# EAGLE schematic tf330 (EAGLE 9.5.2)

## Sheet 1 of 3
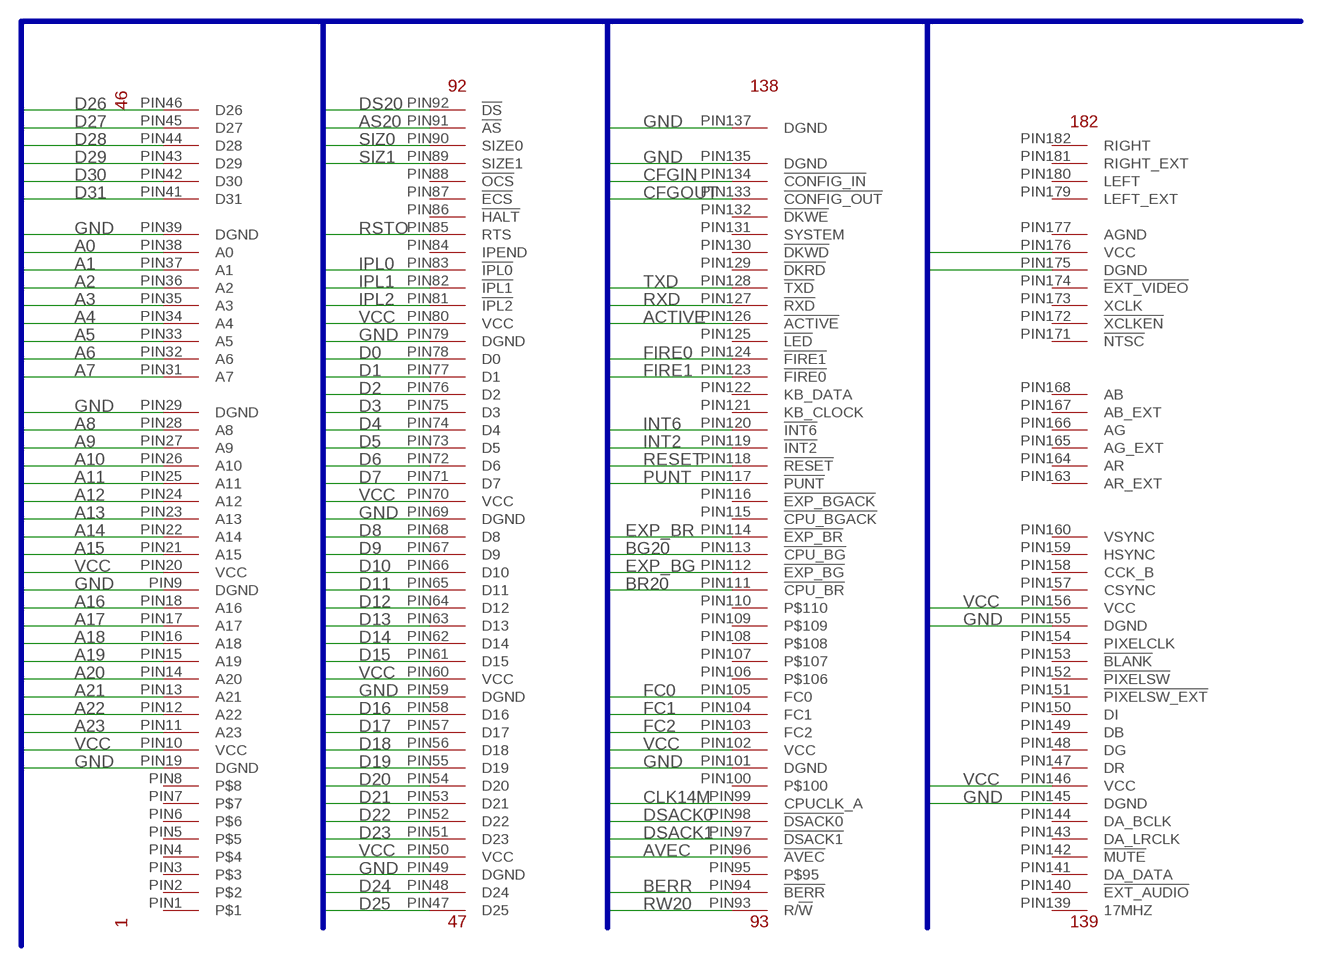
[diagram p0: schematic, sheet 1]

### Parts
CONN1  MCA_CONN_182  [MCA_CONN_182]

### Nets
A0: CONN1.PIN38(A0) ; also sheet 2
A1: CONN1.PIN37(A1) ; also sheet 2
A2: CONN1.PIN36(A2) ; also sheet 2
A3: CONN1.PIN35(A3) ; also sheet 2
A4: CONN1.PIN34(A4) ; also sheet 2
A5: CONN1.PIN33(A5) ; also sheet 2
A6: CONN1.PIN32(A6) ; also sheet 2
A7: CONN1.PIN31(A7) ; also sheet 2
A8: CONN1.PIN28(A8) ; also sheet 2
A9: CONN1.PIN27(A9) ; also sheet 2
A10: CONN1.PIN26(A10) ; also sheet 2
A11: CONN1.PIN25(A11) ; also sheet 2
A12: CONN1.PIN24(A12) ; also sheet 2
A13: CONN1.PIN23(A13) ; also sheet 2
A14: CONN1.PIN22(A14) ; also sheet 2
A15: CONN1.PIN21(A15) ; also sheet 2
A16: CONN1.PIN18(A16) ; also sheet 2
A17: CONN1.PIN17(A17) ; also sheet 2
A18: CONN1.PIN16(A18) ; also sheet 2
A19: CONN1.PIN15(A19) ; also sheet 2
A20: CONN1.PIN14(A20) ; also sheet 2
A21: CONN1.PIN13(A21) ; also sheet 2
A22: CONN1.PIN12(A22) ; also sheet 2
A23: CONN1.PIN11(A23) ; also sheet 2
ACTIVE: CONN1.PIN126(!ACTIVE) ; also sheet 2
AS20: CONN1.PIN91(!AS) ; also sheet 2
AVEC: CONN1.PIN96(!AVEC) ; also sheet 2
BERR: CONN1.PIN94(!BERR) ; also sheet 2
BG20: CONN1.PIN113(!CPU_BG) ; also sheet 2
BR20: CONN1.PIN111(!CPU_BR) ; also sheet 2
CFGIN: CONN1.PIN134(!CONFIG_IN)
CFGOUT: CONN1.PIN133(!CONFIG_OUT)
CLK14M: CONN1.PIN99(CPUCLK_A) ; also sheet 2
D0: CONN1.PIN78(D0) ; also sheet 2,3
D1: CONN1.PIN77(D1) ; also sheet 2,3
D2: CONN1.PIN76(D2) ; also sheet 2,3
D3: CONN1.PIN75(D3) ; also sheet 2,3
D4: CONN1.PIN74(D4) ; also sheet 2,3
D5: CONN1.PIN73(D5) ; also sheet 2,3
D6: CONN1.PIN72(D6) ; also sheet 2,3
D7: CONN1.PIN71(D7) ; also sheet 2,3
D8: CONN1.PIN68(D8) ; also sheet 2,3
D9: CONN1.PIN67(D9) ; also sheet 2,3
D10: CONN1.PIN66(D10) ; also sheet 2,3
D11: CONN1.PIN65(D11) ; also sheet 2,3
D12: CONN1.PIN64(D12) ; also sheet 2,3
D13: CONN1.PIN63(D13) ; also sheet 2,3
D14: CONN1.PIN62(D14) ; also sheet 2,3
D15: CONN1.PIN61(D15) ; also sheet 2,3
D16: CONN1.PIN58(D16) ; also sheet 2,3
D17: CONN1.PIN57(D17) ; also sheet 2,3
D18: CONN1.PIN56(D18) ; also sheet 2,3
D19: CONN1.PIN55(D19) ; also sheet 2,3
D20: CONN1.PIN54(D20) ; also sheet 2,3
D21: CONN1.PIN53(D21) ; also sheet 2,3
D22: CONN1.PIN52(D22) ; also sheet 2,3
D23: CONN1.PIN51(D23) ; also sheet 2,3
D24: CONN1.PIN48(D24) ; also sheet 2,3
D25: CONN1.PIN47(D25) ; also sheet 2,3
D26: CONN1.PIN46(D26) ; also sheet 2,3
D27: CONN1.PIN45(D27) ; also sheet 2,3
D28: CONN1.PIN44(D28) ; also sheet 2,3
D29: CONN1.PIN43(D29) ; also sheet 2,3
D30: CONN1.PIN42(D30) ; also sheet 2,3
D31: CONN1.PIN41(D31) ; also sheet 2,3
DS20: CONN1.PIN92(!DS) ; also sheet 2
DSACK0: CONN1.PIN98(!DSACK0) ; also sheet 2
DSACK1: CONN1.PIN97(!DSACK1) ; also sheet 2
EXP_BG: CONN1.PIN112(!EXP_BG) ; also sheet 2
EXP_BR: CONN1.PIN114(!EXP_BR) ; also sheet 2
FC0: CONN1.PIN105(FC0) ; also sheet 2
FC1: CONN1.PIN104(FC1) ; also sheet 2
FC2: CONN1.PIN103(FC2) ; also sheet 2
FIRE0: CONN1.PIN124(!FIRE1)
FIRE1: CONN1.PIN123(!FIRE0)
GND: CONN1.PIN9(DGND) CONN1.PIN19(DGND) CONN1.PIN29(DGND) CONN1.PIN39(DGND) CONN1.PIN49(DGND) CONN1.PIN59(DGND) CONN1.PIN69(DGND) CONN1.PIN79(DGND) CONN1.PIN101(DGND) CONN1.PIN135(DGND) CONN1.PIN137(DGND) CONN1.PIN145(DGND) CONN1.PIN155(DGND) CONN1.PIN175(DGND) ; also sheet 2,3
INT2: CONN1.PIN119(!INT2) ; also sheet 2
INT6: CONN1.PIN120(!INT6)
IPL0: CONN1.PIN83(!IPL0) ; also sheet 2
IPL1: CONN1.PIN82(!IPL1) ; also sheet 2
IPL2: CONN1.PIN81(!IPL2) ; also sheet 2
PUNT: CONN1.PIN117(!PUNT) ; also sheet 2
RESET: CONN1.PIN118(!RESET) ; also sheet 2
RSTO: CONN1.PIN85(RTS) ; also sheet 2
RW20: CONN1.PIN93(R/!W) ; also sheet 2
RXD: CONN1.PIN127(!RXD) ; also sheet 2
SIZ0: CONN1.PIN90(SIZE0) ; also sheet 2
SIZ1: CONN1.PIN89(SIZE1) ; also sheet 2
TXD: CONN1.PIN128(!TXD) ; also sheet 2
VCC: CONN1.PIN10(VCC) CONN1.PIN20(VCC) CONN1.PIN50(VCC) CONN1.PIN60(VCC) CONN1.PIN70(VCC) CONN1.PIN80(VCC) CONN1.PIN102(VCC) CONN1.PIN146(VCC) CONN1.PIN156(VCC) CONN1.PIN176(VCC) ; also sheet 2
Unconnected: CONN1.PIN1 CONN1.PIN2 CONN1.PIN3 CONN1.PIN4 CONN1.PIN5 CONN1.PIN6 CONN1.PIN7 CONN1.PIN8 CONN1.PIN84(IPEND) CONN1.PIN86(!HALT) CONN1.PIN87(!ECS) CONN1.PIN88(!OCS) CONN1.PIN95 CONN1.PIN100 CONN1.PIN106 CONN1.PIN107 CONN1.PIN108 CONN1.PIN109 CONN1.PIN110 CONN1.PIN115(!CPU_BGACK) CONN1.PIN116(!EXP_BGACK) CONN1.PIN121(KB_CLOCK) CONN1.PIN122(KB_DATA) CONN1.PIN125(!LED) CONN1.PIN129(!DKRD) CONN1.PIN130(!DKWD) CONN1.PIN131(SYSTEM) CONN1.PIN132(!DKWE) CONN1.PIN139(17MHZ) CONN1.PIN140(!EXT_AUDIO) CONN1.PIN141(DA_DATA) CONN1.PIN142(!MUTE) CONN1.PIN143(DA_LRCLK) CONN1.PIN144(DA_BCLK) CONN1.PIN147(DR) CONN1.PIN148(DG) CONN1.PIN149(DB) CONN1.PIN150(DI) CONN1.PIN151(!PIXELSW_EXT) CONN1.PIN152(!PIXELSW) CONN1.PIN153(!BLANK) CONN1.PIN154(PIXELCLK) CONN1.PIN157(CSYNC) CONN1.PIN158(CCK_B) CONN1.PIN159(HSYNC) CONN1.PIN160(VSYNC) CONN1.PIN163(AR_EXT) CONN1.PIN164(AR) CONN1.PIN165(AG_EXT) CONN1.PIN166(AG) CONN1.PIN167(AB_EXT) CONN1.PIN168(AB) CONN1.PIN171(!NTSC) CONN1.PIN172(!XCLKEN) CONN1.PIN173(XCLK) CONN1.PIN174(!EXT_VIDEO) CONN1.PIN179(LEFT_EXT) CONN1.PIN180(LEFT) CONN1.PIN181(RIGHT_EXT) CONN1.PIN182(RIGHT)

### Buses
VCC,VCC33,GND,AGND,CLK100M,CLK50M,CLKCPU,CLK14M,CLKRAM,CLKRAME,A[0..31],ACTIVE,ARAM[0..12],AS30,AS20,AUX[0..2],AVEC,BA[0..1],BERR,BG30,BG20,BGACK20,BGACK30,BR20,BR30,BUSEN,CAS,CBACK,CBREQ,CDIS,CFGIN,CFGOUT,CIIN,CIIOUT,D[0..31],DRAM[0..31],DBEN,DQM[0..3],DS20,DS30,DSACK[0..1],DS30ACK[0..1],EXP_BR,EXP_BG,FC[0..2],FIRE[0..1],HALT,IDECS[0..1],IDEINT,IDELED,IDEWAIT,INT2,INT6,INTCYCLE,IOR,IOW,IPL[0..2],MMUDIS,PUNT,RAMCS,RAMOE,RAMWE,RAS,REFILL,RESET,RSTO,RW20,RW30,RXD,RXD_EXT,SIZ[0..1],SPARE,STATUS,STERM,TXD,TXD_EXT,TCK,TDI,TDO,TMS

## Sheet 2 of 3
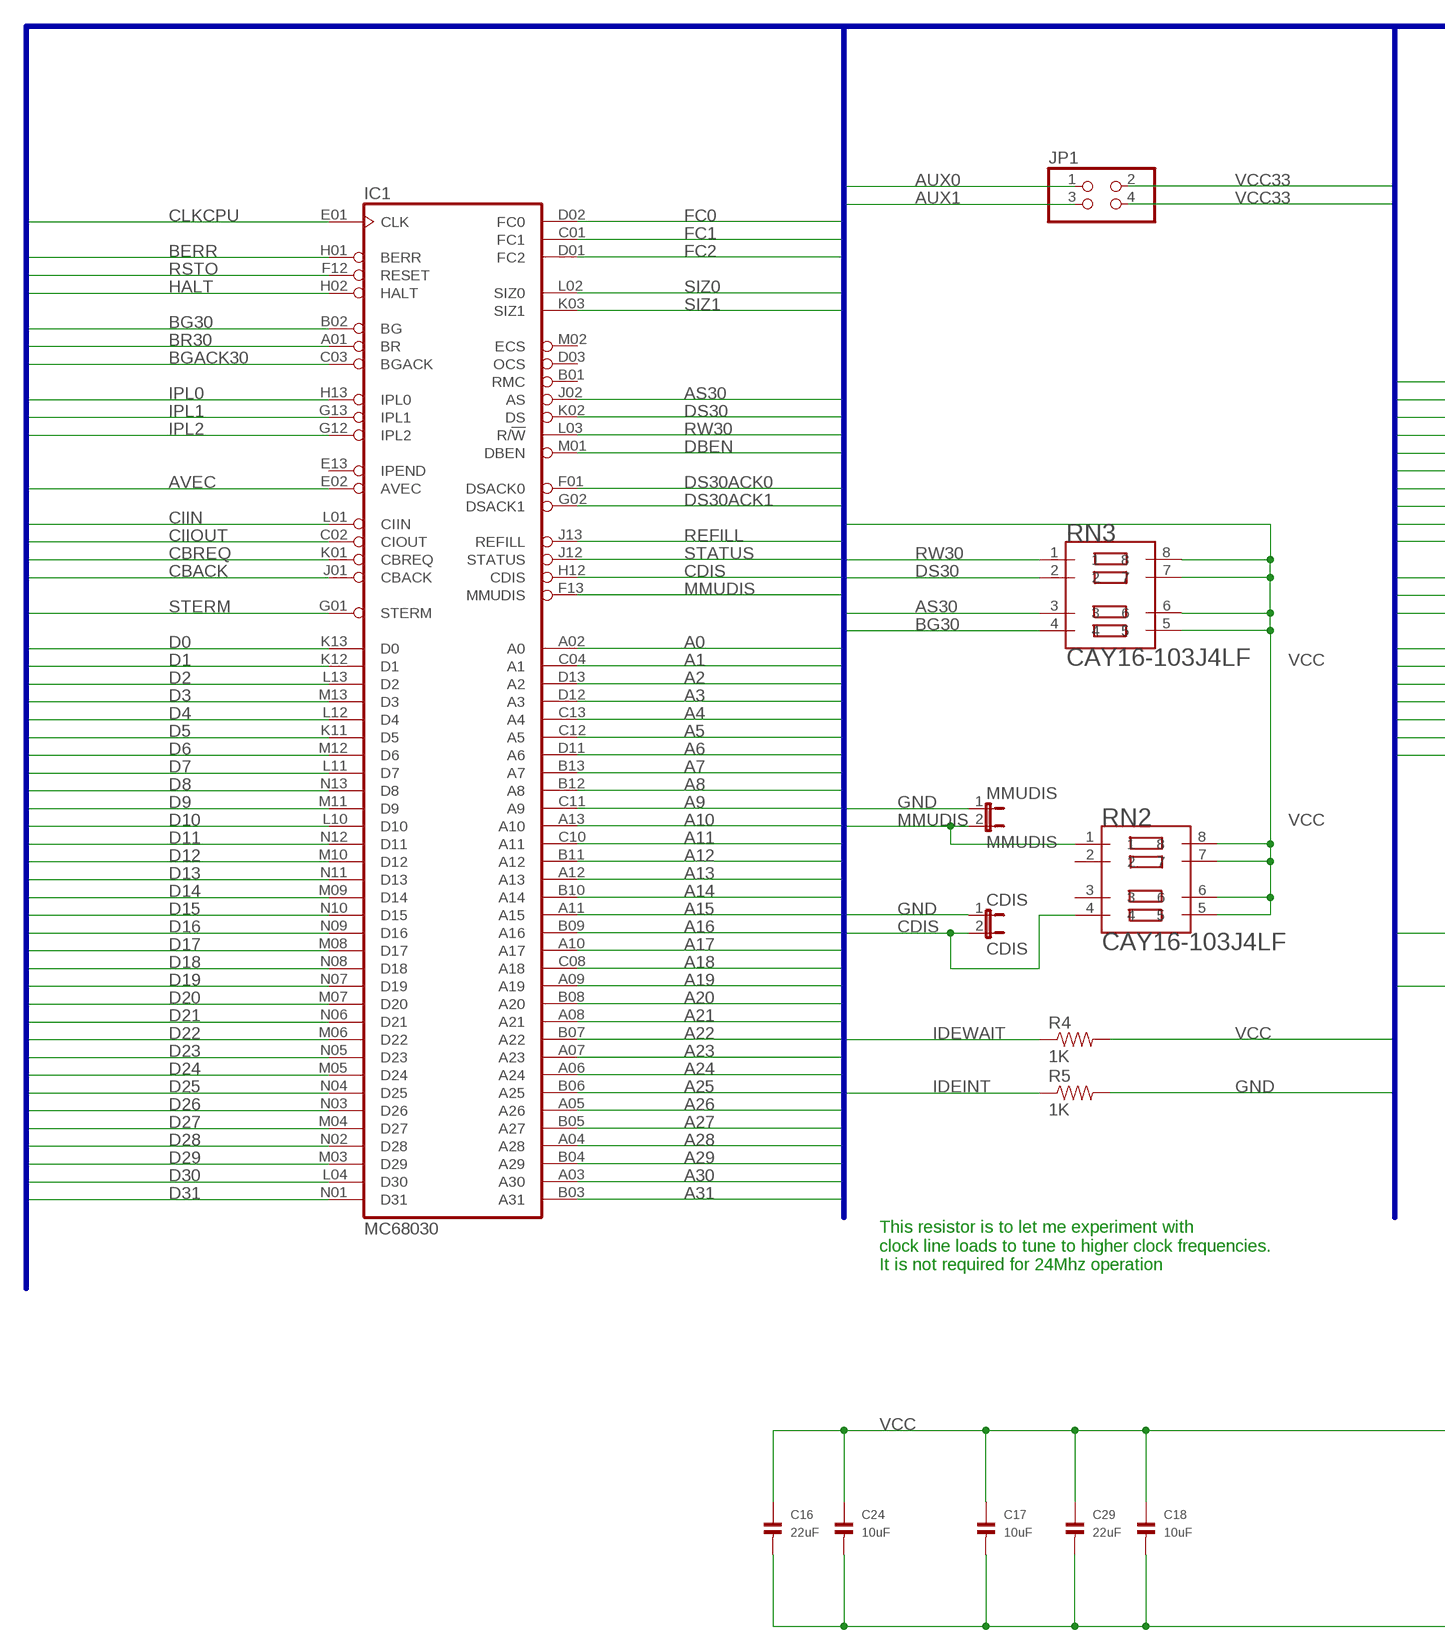
[diagram p1: schematic, sheet 2, part 1 of 2]
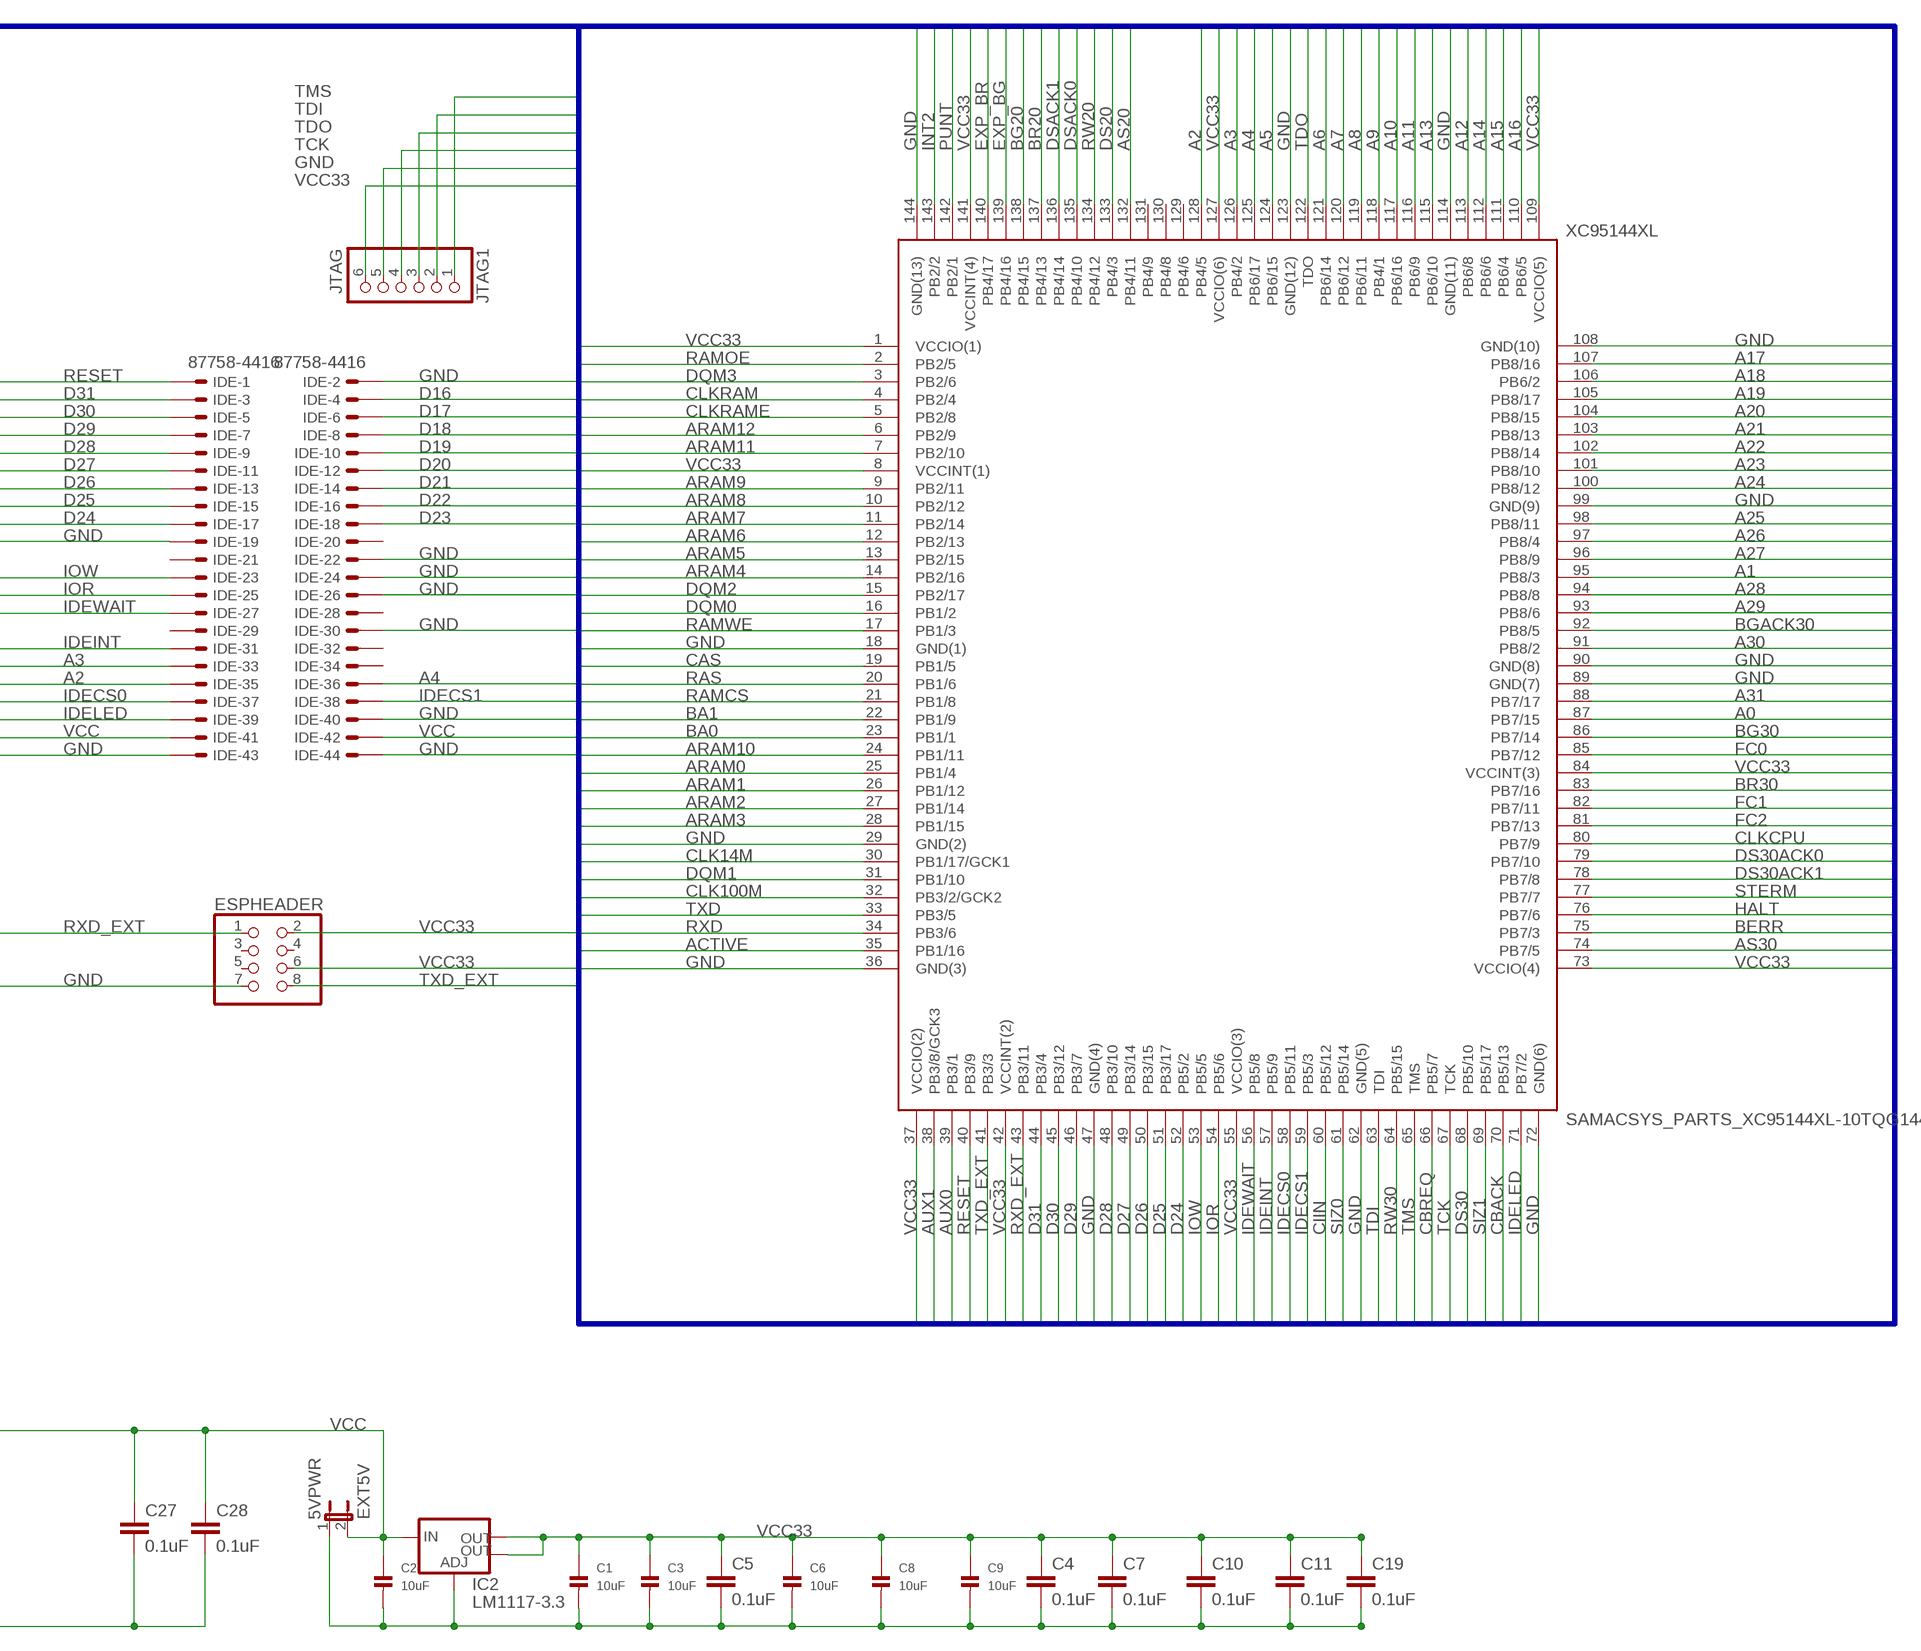
[diagram p2: schematic, sheet 2, part 2 of 2]

### Parts
5VPWR  EXT5V  JUMPER-2PTH  [1X02]
C1  10uF  CAP_CERAMIC1206  [1206]
C2  10uF  CAP_CERAMIC1206  [1206]
C3  10uF  CAP_CERAMIC1206  [1206]
C4  0.1uF  0.1UF-25V(+80/-20%)(0603)  [0603-CAP]
C5  0.1uF  0.1UF-25V(+80/-20%)(0603)  [0603-CAP]
C6  10uF  CAP_CERAMIC1206  [1206]
C7  0.1uF  0.1UF-25V(+80/-20%)(0603)  [0603-CAP]
C8  10uF  CAP_CERAMIC1206  [1206]
C9  10uF  CAP_CERAMIC1206  [1206]
C10  0.1uF  0.1UF-25V(+80/-20%)(0603)  [0603-CAP]
C11  0.1uF  0.1UF-25V(+80/-20%)(0603)  [0603-CAP]
C16  22uF  CAP_CERAMIC1206  [1206]
C17  10uF  CAP_CERAMIC1206  [1206]
C18  10uF  CAP_CERAMIC1206  [1206]
C19  0.1uF  0.1UF-25V(+80/-20%)(0603)  [0603-CAP]
C24  10uF  CAP_CERAMIC1206  [1206]
C27  0.1uF  0.1UF-25V(+80/-20%)(0603)  [0603-CAP]
C28  0.1uF  0.1UF-25V(+80/-20%)(0603)  [0603-CAP]
C29  22uF  CAP_CERAMIC1206  [1206]
CDIS  CDIS  JUMPER-2PTH  [1X02]
ESPHEADER  PINHD-2X4  [2X04]
IC1  MC68030  MC68030RC  [MPGA128]
IC2  LM1117-3.3  V_REG_LM1117SOT223  [SOT223]
IDE  87758-4416  [87758-4416]
JP1  PINHD-2X2  [2X02]
JTAG1  JTAG  HEADER-1X6ROUND  [1X06_ROUND]
MMUDIS  MMUDIS  JUMPER-2PTH  [1X02]
R4  1K  0.05OHM-1/5W-1%(0603)  [0603]
R5  1K  0.05OHM-1/5W-1%(0603)  [0603]
RN2  CAY16-103J4LF  [RESCAXE80P320X160-8N]
RN3  CAY16-103J4LF  [RESCAXE80P320X160-8N]
XC95144XL  SAMACSYS_PARTS_XC95144XL-10TQG144I  [SAMACSYS_PARTS_QFP50P2200X2200X160-144N]

### Nets
A0: IC1.A02(A0) XC95144XL.87(PB7/15) ; also sheet 1
A1: IC1.C04(A1) XC95144XL.95(PB8/3) ; also sheet 1
A2: IC1.D13(A2) IDE.35 XC95144XL.128(PB4/5) ; also sheet 1
A3: IC1.D12(A3) IDE.33 XC95144XL.126(PB4/2) ; also sheet 1
A4: IC1.C13(A4) IDE.36 XC95144XL.125(PB6/17) ; also sheet 1
A5: IC1.C12(A5) XC95144XL.124(PB6/15) ; also sheet 1
A6: IC1.D11(A6) XC95144XL.121(PB6/14) ; also sheet 1
A7: IC1.B13(A7) XC95144XL.120(PB6/12) ; also sheet 1
A8: IC1.B12(A8) XC95144XL.119(PB6/11) ; also sheet 1
A9: IC1.C11(A9) XC95144XL.118(PB4/1) ; also sheet 1
A10: IC1.A13(A10) XC95144XL.117(PB6/16) ; also sheet 1
A11: IC1.C10(A11) XC95144XL.116(PB6/9) ; also sheet 1
A12: IC1.B11(A12) XC95144XL.113(PB6/8) ; also sheet 1
A13: IC1.A12(A13) XC95144XL.115(PB6/10) ; also sheet 1
A14: IC1.B10(A14) XC95144XL.112(PB6/6) ; also sheet 1
A15: IC1.A11(A15) XC95144XL.111(PB6/4) ; also sheet 1
A16: IC1.B09(A16) XC95144XL.110(PB6/5) ; also sheet 1
A17: IC1.A10(A17) XC95144XL.107(PB8/16) ; also sheet 1
A18: IC1.C08(A18) XC95144XL.106(PB6/2) ; also sheet 1
A19: IC1.A09(A19) XC95144XL.105(PB8/17) ; also sheet 1
A20: IC1.B08(A20) XC95144XL.104(PB8/15) ; also sheet 1
A21: IC1.A08(A21) XC95144XL.103(PB8/13) ; also sheet 1
A22: IC1.B07(A22) XC95144XL.102(PB8/14) ; also sheet 1
A23: IC1.A07(A23) XC95144XL.101(PB8/10) ; also sheet 1
A24: IC1.A06(A24) XC95144XL.100(PB8/12)
A25: IC1.B06(A25) XC95144XL.98(PB8/11)
A26: IC1.A05(A26) XC95144XL.97(PB8/4)
A27: IC1.B05(A27) XC95144XL.96(PB8/9)
A28: IC1.A04(A28) XC95144XL.94(PB8/8)
A29: IC1.B04(A29) XC95144XL.93(PB8/6)
A30: IC1.A03(A30) XC95144XL.91(PB8/2)
A31: IC1.B03(A31) XC95144XL.88(PB7/17)
ACTIVE: XC95144XL.35(PB1/16) ; also sheet 1
ARAM0: XC95144XL.25(PB1/4) ; also sheet 3
ARAM1: XC95144XL.26(PB1/12) ; also sheet 3
ARAM2: XC95144XL.27(PB1/14) ; also sheet 3
ARAM3: XC95144XL.28(PB1/15) ; also sheet 3
ARAM4: XC95144XL.14(PB2/16) ; also sheet 3
ARAM5: XC95144XL.13(PB2/15) ; also sheet 3
ARAM6: XC95144XL.12(PB2/13) ; also sheet 3
ARAM7: XC95144XL.11(PB2/14) ; also sheet 3
ARAM8: XC95144XL.10(PB2/12) ; also sheet 3
ARAM9: XC95144XL.9(PB2/11) ; also sheet 3
ARAM10: XC95144XL.24(PB1/11) ; also sheet 3
ARAM11: XC95144XL.7(PB2/10) ; also sheet 3
ARAM12: XC95144XL.6(PB2/9) ; also sheet 3
AS20: XC95144XL.132(PB4/11) ; also sheet 1
AS30: IC1.J02(AS) RN3.3 XC95144XL.74(PB7/5)
AUX0: JP1.1 XC95144XL.39(PB3/1)
AUX1: JP1.3 XC95144XL.38(PB3/8/GCK3)
AVEC: IC1.E02(AVEC) ; also sheet 1
BA0: XC95144XL.23(PB1/1) ; also sheet 3
BA1: XC95144XL.22(PB1/9) ; also sheet 3
BERR: IC1.H01(BERR) XC95144XL.75(PB7/3) ; also sheet 1
BG20: XC95144XL.138(PB4/15) ; also sheet 1
BG30: IC1.B02(BG) RN3.4 XC95144XL.86(PB7/14)
BGACK30: IC1.C03(BGACK) XC95144XL.92(PB8/5)
BR20: XC95144XL.137(PB4/13) ; also sheet 1
BR30: IC1.A01(BR) XC95144XL.83(PB7/16)
CAS: XC95144XL.19(PB1/5) ; also sheet 3
CBACK: IC1.J01(CBACK) XC95144XL.70(PB5/13)
CBREQ: IC1.K01(CBREQ) XC95144XL.66(PB5/7)
CDIS: CDIS.2 IC1.H12(CDIS) RN2.4
CIIN: IC1.L01(CIIN) XC95144XL.60(PB5/12)
CIIOUT: IC1.C02(CIOUT)
CLK14M: XC95144XL.30(PB1/17/GCK1) ; also sheet 1
CLK100M: XC95144XL.32(PB3/2/GCK2) ; also sheet 3
CLKCPU: IC1.E01(CLK) XC95144XL.80(PB7/9)
CLKRAM: XC95144XL.4(PB2/4) ; also sheet 3
CLKRAME: XC95144XL.5(PB2/8) ; also sheet 3
D0: IC1.K13(D0) ; also sheet 1,3
D1: IC1.K12(D1) ; also sheet 1,3
D2: IC1.L13(D2) ; also sheet 1,3
D3: IC1.M13(D3) ; also sheet 1,3
D4: IC1.L12(D4) ; also sheet 1,3
D5: IC1.K11(D5) ; also sheet 1,3
D6: IC1.M12(D6) ; also sheet 1,3
D7: IC1.L11(D7) ; also sheet 1,3
D8: IC1.N13(D8) ; also sheet 1,3
D9: IC1.M11(D9) ; also sheet 1,3
D10: IC1.L10(D10) ; also sheet 1,3
D11: IC1.N12(D11) ; also sheet 1,3
D12: IC1.M10(D12) ; also sheet 1,3
D13: IC1.N11(D13) ; also sheet 1,3
D14: IC1.M09(D14) ; also sheet 1,3
D15: IC1.N10(D15) ; also sheet 1,3
D16: IC1.N09(D16) IDE.4 ; also sheet 1,3
D17: IC1.M08(D17) IDE.6 ; also sheet 1,3
D18: IC1.N08(D18) IDE.8 ; also sheet 1,3
D19: IC1.N07(D19) IDE.10 ; also sheet 1,3
D20: IC1.M07(D20) IDE.12 ; also sheet 1,3
D21: IC1.N06(D21) IDE.14 ; also sheet 1,3
D22: IC1.M06(D22) IDE.16 ; also sheet 1,3
D23: IC1.N05(D23) IDE.18 ; also sheet 1,3
D24: IC1.M05(D24) IDE.17 XC95144XL.52(PB5/2) ; also sheet 1,3
D25: IC1.N04(D25) IDE.15 XC95144XL.51(PB3/17) ; also sheet 1,3
D26: IC1.N03(D26) IDE.13 XC95144XL.50(PB3/15) ; also sheet 1,3
D27: IC1.M04(D27) IDE.11 XC95144XL.49(PB3/14) ; also sheet 1,3
D28: IC1.N02(D28) IDE.9 XC95144XL.48(PB3/10) ; also sheet 1,3
D29: IC1.M03(D29) IDE.7 XC95144XL.46(PB3/7) ; also sheet 1,3
D30: IC1.L04(D30) IDE.5 XC95144XL.45(PB3/12) ; also sheet 1,3
D31: IC1.N01(D31) IDE.3 XC95144XL.44(PB3/4) ; also sheet 1,3
DBEN: IC1.M01(DBEN)
DQM0: XC95144XL.16(PB1/2) ; also sheet 3
DQM1: XC95144XL.31(PB1/10) ; also sheet 3
DQM2: XC95144XL.15(PB2/17) ; also sheet 3
DQM3: XC95144XL.3(PB2/6) ; also sheet 3
DS20: XC95144XL.133(PB4/3) ; also sheet 1
DS30: IC1.K02(DS) RN3.2 XC95144XL.68(PB5/10)
DS30ACK0: IC1.F01(DSACK0) XC95144XL.79(PB7/10)
DS30ACK1: IC1.G02(DSACK1) XC95144XL.78(PB7/8)
DSACK0: XC95144XL.135(PB4/10) ; also sheet 1
DSACK1: XC95144XL.136(PB4/14) ; also sheet 1
EXP_BG: XC95144XL.139(PB4/16) ; also sheet 1
EXP_BR: XC95144XL.140(PB4/17) ; also sheet 1
FC0: IC1.D02(FC0) XC95144XL.85(PB7/12) ; also sheet 1
FC1: IC1.C01(FC1) XC95144XL.82(PB7/11) ; also sheet 1
FC2: IC1.D01(FC2) XC95144XL.81(PB7/13) ; also sheet 1
GND: 5VPWR.1 C1.2 C2.2 C3.2 C4.2 C5.2 C6.2 C7.2 C8.2 C9.2 C10.2 C11.2 C16.2 C17.2 C18.2 C19.2 C24.2 C27.2 C28.2 C29.2 CDIS.1 ESPHEADER.7 IC2.1(ADJ) IDE.2 IDE.19 IDE.22 IDE.24 IDE.26 IDE.30 IDE.40 IDE.43 IDE.44 JTAG1.5 MMUDIS.1 R5.2 XC95144XL.18(GND(1)) XC95144XL.29(GND(2)) XC95144XL.36(GND(3)) XC95144XL.47(GND(4)) XC95144XL.62(GND(5)) XC95144XL.72(GND(6)) XC95144XL.89(GND(7)) XC95144XL.90(GND(8)) XC95144XL.99(GND(9)) XC95144XL.108(GND(10)) XC95144XL.114(GND(11)) XC95144XL.123(GND(12)) XC95144XL.144(GND(13)) ; also sheet 1,3
HALT: IC1.H02(HALT) XC95144XL.76(PB7/6)
IDECS0: IDE.37 XC95144XL.58(PB5/11)
IDECS1: IDE.38 XC95144XL.59(PB5/3)
IDEINT: IDE.31 R5.1 XC95144XL.57(PB5/9)
IDELED: IDE.39 XC95144XL.71(PB7/2)
IDEWAIT: IDE.27 R4.1 XC95144XL.56(PB5/8)
INT2: XC95144XL.143(PB2/2) ; also sheet 1
IOR: IDE.25 XC95144XL.54(PB5/6)
IOW: IDE.23 XC95144XL.53(PB5/5)
IPL0: IC1.H13(IPL0) ; also sheet 1
IPL1: IC1.G13(IPL1) ; also sheet 1
IPL2: IC1.G12(IPL2) ; also sheet 1
MMUDIS: IC1.F13(MMUDIS) MMUDIS.2 RN2.1
PUNT: XC95144XL.142(PB2/1) ; also sheet 1
RAMCS: XC95144XL.21(PB1/8) ; also sheet 3
RAMOE: XC95144XL.2(PB2/5) ; also sheet 3
RAMWE: XC95144XL.17(PB1/3) ; also sheet 3
RAS: XC95144XL.20(PB1/6) ; also sheet 3
REFILL: IC1.J13(REFILL)
RESET: IDE.1 XC95144XL.40(PB3/9) ; also sheet 1
RSTO: IC1.F12(RESET) ; also sheet 1
RW20: XC95144XL.134(PB4/12) ; also sheet 1
RW30: IC1.L03(R/!W) RN3.1 XC95144XL.64(PB5/15)
RXD: XC95144XL.34(PB3/6) ; also sheet 1
RXD_EXT: ESPHEADER.1 XC95144XL.43(PB3/11)
SIZ0: IC1.L02(SIZ0) XC95144XL.61(PB5/14) ; also sheet 1
SIZ1: IC1.K03(SIZ1) XC95144XL.69(PB5/17) ; also sheet 1
STATUS: IC1.J12(STATUS)
STERM: IC1.G01(STERM) XC95144XL.77(PB7/7)
TCK: JTAG1.4 XC95144XL.67(TCK)
TDI: JTAG1.2 XC95144XL.63(TDI)
TDO: JTAG1.3 XC95144XL.122(TDO)
TMS: JTAG1.1 XC95144XL.65(TMS)
TXD: XC95144XL.33(PB3/5) ; also sheet 1
TXD_EXT: ESPHEADER.8 XC95144XL.41(PB3/3)
VCC: 5VPWR.2 C2.1 C16.1 C17.1 C18.1 C24.1 C27.1 C28.1 C29.1 IC2.3(IN) IDE.41 IDE.42 R4.2 RN2.5 RN2.6 RN2.7 RN2.8 RN3.5 RN3.6 RN3.7 RN3.8 ; also sheet 1
VCC33: C1.1 C3.1 C4.1 C5.1 C6.1 C7.1 C8.1 C9.1 C10.1 C11.1 C19.1 ESPHEADER.2 ESPHEADER.6 IC2.2(OUT) IC2.4(OUT) JP1.2 JP1.4 JTAG1.6 XC95144XL.1(VCCIO(1)) XC95144XL.8(VCCINT(1)) XC95144XL.37(VCCIO(2)) XC95144XL.42(VCCINT(2)) XC95144XL.55(VCCIO(3)) XC95144XL.73(VCCIO(4)) XC95144XL.84(VCCINT(3)) XC95144XL.109(VCCIO(5)) XC95144XL.127(VCCIO(6)) XC95144XL.141(VCCINT(4)) ; also sheet 3
Unconnected: ESPHEADER.3 ESPHEADER.4 ESPHEADER.5 IC1.B01(RMC) IC1.D03(OCS) IC1.E13(IPEND) IC1.M02(ECS) IDE.20 IDE.21 IDE.28 IDE.29 IDE.32 IDE.34 RN2.2 RN2.3 XC95144XL.129(PB4/6) XC95144XL.130(PB4/8) XC95144XL.131(PB4/9)

### Buses
VCC,VCC33,GND,AGND,CLK100M,CLK50M,CLKCPU,CLK14M,CLKRAM,CLKRAME,A[0..31],ACTIVE,ARAM[0..12],AS30,AS20,AUX[0..2],AVEC,BA[0..1],BERR,BG30,BG20,BGACK20,BGACK30,BR20,BR30,BUSEN,CAS,CBACK,CBREQ,CDIS,CFGIN,CFGOUT,CIIN,CIIOUT,D[0..31],DRAM[0..31],DBEN,DQM[0..3],DS20,DS30,DSACK[0..1],DS30ACK[0..1],EXP_BR,EXP_BG,FC[0..2],FIRE[0..1],HALT,IDECS[0..1],IDEINT,IDELED,IDEWAIT,INT2,INT6,INTCYCLE,IOR,IOW,IPL[0..2],MMUDIS,PUNT,RAMCS,RAMOE,RAMWE,RAS,REFILL,RESET,RSTO,RW20,RW30,RXD,RXD_EXT,SIZ[0..1],SPARE,STATUS,STERM,TXD,TXD_EXT,TCK,TDI,TDO,TMS

### Notes on the sheet
- This resistor is to let me experiment with 
  clock line loads to tune to higher clock frequencies. 
  It is not required for 24Mhz operation

## Sheet 3 of 3
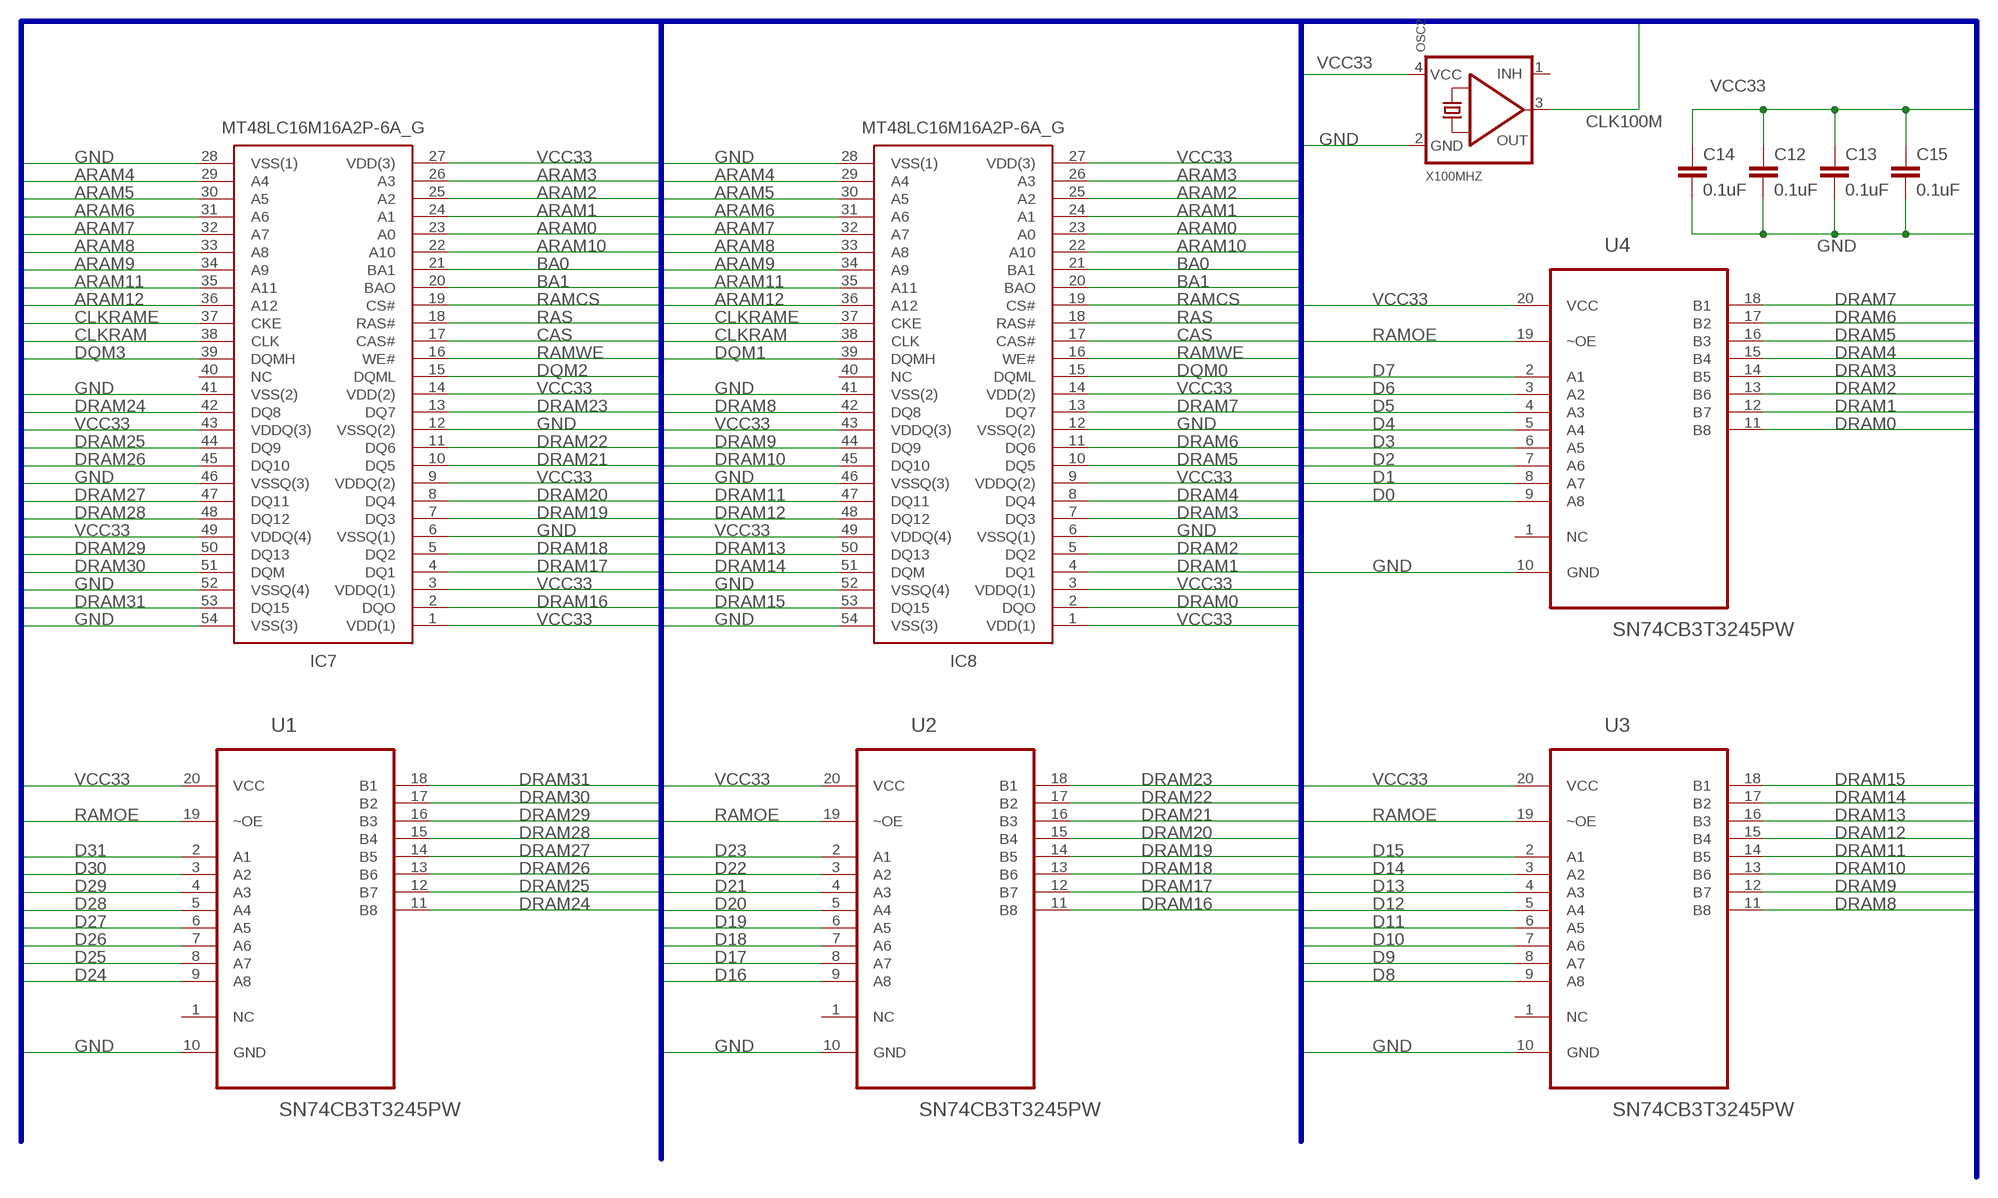
[diagram p3: schematic, sheet 3]

### Parts
C12  0.1uF  0.1UF-25V(+80/-20%)(0603)  [0603-CAP]
C13  0.1uF  0.1UF-25V(+80/-20%)(0603)  [0603-CAP]
C14  0.1uF  0.1UF-25V(+80/-20%)(0603)  [0603-CAP]
C15  0.1uF  0.1UF-25V(+80/-20%)(0603)  [0603-CAP]
IC7  MT48LC16M16A2P-6A_G  [SOP80P1176X120-54N]
IC8  MT48LC16M16A2P-6A_G  [SOP80P1176X120-54N]
OSC2  X100MHZ  OSCILLATOR  [OSC_7X5MM]
U1  SN74CB3T3245PW  [SOP65P640X120-20N]
U2  SN74CB3T3245PW  [SOP65P640X120-20N]
U3  SN74CB3T3245PW  [SOP65P640X120-20N]
U4  SN74CB3T3245PW  [SOP65P640X120-20N]

### Nets
ARAM0: IC7.23(A0) IC8.23(A0) ; also sheet 2
ARAM1: IC7.24(A1) IC8.24(A1) ; also sheet 2
ARAM2: IC7.25(A2) IC8.25(A2) ; also sheet 2
ARAM3: IC7.26(A3) IC8.26(A3) ; also sheet 2
ARAM4: IC7.29(A4) IC8.29(A4) ; also sheet 2
ARAM5: IC7.30(A5) IC8.30(A5) ; also sheet 2
ARAM6: IC7.31(A6) IC8.31(A6) ; also sheet 2
ARAM7: IC7.32(A7) IC8.32(A7) ; also sheet 2
ARAM8: IC7.33(A8) IC8.33(A8) ; also sheet 2
ARAM9: IC7.34(A9) IC8.34(A9) ; also sheet 2
ARAM10: IC7.22(A10) IC8.22(A10) ; also sheet 2
ARAM11: IC7.35(A11) IC8.35(A11) ; also sheet 2
ARAM12: IC7.36(A12) IC8.36(A12) ; also sheet 2
BA0: IC7.21(BA1) IC8.21(BA1) ; also sheet 2
BA1: IC7.20(BAO) IC8.20(BAO) ; also sheet 2
CAS: IC7.17(CAS#) IC8.17(CAS#) ; also sheet 2
CLK100M: OSC2.3(OUT) ; also sheet 2
CLKRAM: IC7.38(CLK) IC8.38(CLK) ; also sheet 2
CLKRAME: IC7.37(CKE) IC8.37(CKE) ; also sheet 2
D0: U4.9(A8) ; also sheet 1,2
D1: U4.8(A7) ; also sheet 1,2
D2: U4.7(A6) ; also sheet 1,2
D3: U4.6(A5) ; also sheet 1,2
D4: U4.5(A4) ; also sheet 1,2
D5: U4.4(A3) ; also sheet 1,2
D6: U4.3(A2) ; also sheet 1,2
D7: U4.2(A1) ; also sheet 1,2
D8: U3.9(A8) ; also sheet 1,2
D9: U3.8(A7) ; also sheet 1,2
D10: U3.7(A6) ; also sheet 1,2
D11: U3.6(A5) ; also sheet 1,2
D12: U3.5(A4) ; also sheet 1,2
D13: U3.4(A3) ; also sheet 1,2
D14: U3.3(A2) ; also sheet 1,2
D15: U3.2(A1) ; also sheet 1,2
D16: U2.9(A8) ; also sheet 1,2
D17: U2.8(A7) ; also sheet 1,2
D18: U2.7(A6) ; also sheet 1,2
D19: U2.6(A5) ; also sheet 1,2
D20: U2.5(A4) ; also sheet 1,2
D21: U2.4(A3) ; also sheet 1,2
D22: U2.3(A2) ; also sheet 1,2
D23: U2.2(A1) ; also sheet 1,2
D24: U1.9(A8) ; also sheet 1,2
D25: U1.8(A7) ; also sheet 1,2
D26: U1.7(A6) ; also sheet 1,2
D27: U1.6(A5) ; also sheet 1,2
D28: U1.5(A4) ; also sheet 1,2
D29: U1.4(A3) ; also sheet 1,2
D30: U1.3(A2) ; also sheet 1,2
D31: U1.2(A1) ; also sheet 1,2
DQM0: IC8.15(DQML) ; also sheet 2
DQM1: IC8.39(DQMH) ; also sheet 2
DQM2: IC7.15(DQML) ; also sheet 2
DQM3: IC7.39(DQMH) ; also sheet 2
DRAM0: IC8.2(DQO) U4.11(B8)
DRAM1: IC8.4(DQ1) U4.12(B7)
DRAM2: IC8.5(DQ2) U4.13(B6)
DRAM3: IC8.7(DQ3) U4.14(B5)
DRAM4: IC8.8(DQ4) U4.15(B4)
DRAM5: IC8.10(DQ5) U4.16(B3)
DRAM6: IC8.11(DQ6) U4.17(B2)
DRAM7: IC8.13(DQ7) U4.18(B1)
DRAM8: IC8.42(DQ8) U3.11(B8)
DRAM9: IC8.44(DQ9) U3.12(B7)
DRAM10: IC8.45(DQ10) U3.13(B6)
DRAM11: IC8.47(DQ11) U3.14(B5)
DRAM12: IC8.48(DQ12) U3.15(B4)
DRAM13: IC8.50(DQ13) U3.16(B3)
DRAM14: IC8.51(DQM) U3.17(B2)
DRAM15: IC8.53(DQ15) U3.18(B1)
DRAM16: IC7.2(DQO) U2.11(B8)
DRAM17: IC7.4(DQ1) U2.12(B7)
DRAM18: IC7.5(DQ2) U2.13(B6)
DRAM19: IC7.7(DQ3) U2.14(B5)
DRAM20: IC7.8(DQ4) U2.15(B4)
DRAM21: IC7.10(DQ5) U2.16(B3)
DRAM22: IC7.11(DQ6) U2.17(B2)
DRAM23: IC7.13(DQ7) U2.18(B1)
DRAM24: IC7.42(DQ8) U1.11(B8)
DRAM25: IC7.44(DQ9) U1.12(B7)
DRAM26: IC7.45(DQ10) U1.13(B6)
DRAM27: IC7.47(DQ11) U1.14(B5)
DRAM28: IC7.48(DQ12) U1.15(B4)
DRAM29: IC7.50(DQ13) U1.16(B3)
DRAM30: IC7.51(DQM) U1.17(B2)
DRAM31: IC7.53(DQ15) U1.18(B1)
GND: C12.2 C13.2 C14.2 C15.2 IC7.6(VSSQ(1)) IC7.12(VSSQ(2)) IC7.28(VSS(1)) IC7.41(VSS(2)) IC7.46(VSSQ(3)) IC7.52(VSSQ(4)) IC7.54(VSS(3)) IC8.6(VSSQ(1)) IC8.12(VSSQ(2)) IC8.28(VSS(1)) IC8.41(VSS(2)) IC8.46(VSSQ(3)) IC8.52(VSSQ(4)) IC8.54(VSS(3)) OSC2.2(GND) U1.10(GND) U2.10(GND) U3.10(GND) U4.10(GND) ; also sheet 1,2
RAMCS: IC7.19(CS#) IC8.19(CS#) ; also sheet 2
RAMOE: U1.19(~OE) U2.19(~OE) U3.19(~OE) U4.19(~OE) ; also sheet 2
RAMWE: IC7.16(WE#) IC8.16(WE#) ; also sheet 2
RAS: IC7.18(RAS#) IC8.18(RAS#) ; also sheet 2
VCC33: C12.1 C13.1 C14.1 C15.1 IC7.1(VDD(1)) IC7.3(VDDQ(1)) IC7.9(VDDQ(2)) IC7.14(VDD(2)) IC7.27(VDD(3)) IC7.43(VDDQ(3)) IC7.49(VDDQ(4)) IC8.1(VDD(1)) IC8.3(VDDQ(1)) IC8.9(VDDQ(2)) IC8.14(VDD(2)) IC8.27(VDD(3)) IC8.43(VDDQ(3)) IC8.49(VDDQ(4)) OSC2.4(VCC) U1.20(VCC) U2.20(VCC) U3.20(VCC) U4.20(VCC) ; also sheet 2
Unconnected: IC7.40(NC) IC8.40(NC) OSC2.1(INH) U1.1(NC) U2.1(NC) U3.1(NC) U4.1(NC)

### Buses
VCC,VCC33,GND,AGND,CLK100M,CLK50M,CLKCPU,CLK14M,CLKRAM,CLKRAME,A[0..31],ACTIVE,ARAM[0..12],AS30,AS20,AUX[0..2],AVEC,BA[0..1],BERR,BG30,BG20,BGACK20,BGACK30,BR20,BR30,BUSEN,CAS,CBACK,CBREQ,CDIS,CFGIN,CFGOUT,CIIN,CIIOUT,D[0..31],DRAM[0..31],DBEN,DQM[0..3],DS20,DS30,DSACK[0..1],DS30ACK[0..1],EXP_BR,EXP_BG,FC[0..2],FIRE[0..1],HALT,IDECS[0..1],IDEINT,IDELED,IDEWAIT,INT2,INT6,INTCYCLE,IOR,IOW,IPL[0..2],MMUDIS,PUNT,RAMCS,RAMOE,RAMWE,RAS,REFILL,RESET,RSTO,RW20,RW30,RXD,RXD_EXT,SIZ[0..1],SPARE,STATUS,STERM,TXD,TXD_EXT,TCK,TDI,TDO,TMS

## Power pins joined to a net without a drawn wire
AGND: CONN1.PIN177(AGND)
GND: IC1.C05(GND) IC1.C07(GND) IC1.C09(GND) IC1.E03(GND) IC1.E11(GND) IC1.F03(GND) IC1.G03(GND) IC1.G11(GND) IC1.J03(GND) IC1.J11(GND) IC1.L05(GND) IC1.L07(GND) IC1.L08(GND) IC1.L09(GND)
VCC: IC1.C06(VCC) IC1.D04(VCC) IC1.D10(VCC) IC1.F02(VCC) IC1.F11(VCC) IC1.H03(VCC) IC1.H11(VCC) IC1.K04(VCC) IC1.K10(VCC) IC1.L06(VCC)

## Library data of the parts
5VPWR CDIS MMUDIS = SparkFun-Retired:JUMPER-2: Jumper Basic 0.1" spaced jumper. Use with breakaway headers.
C1-C3 C6 C8 C9 C16-C18 C24 C29 = microbuilder:CAP_CERAMIC: Ceramic Capacitors 0402 - 0402 Surface Mount Capacitors 16pF 50V 5% [Digikey: 445-4899-2-ND] 18pF 50V 5% [Digikey: 490-1281-2-ND] 22pF 50V 5% [Digikey: 490-1283-2-ND] 68pF 50V 5% [Digikey: 490-1289-2-ND] 0.1uF 10V 10% [Digikey: 490-1318-2-ND] 1.0uF 6.3V 10% [Digikey: 490-1320-2-ND] 0603 - 0603 Surface Mount Capacitors 16 pF 50V 5% [Digikey: 445-5051-2-ND] 22 pF 50V [Digikey: PCC220ACVTR-ND] 33 pF 50V 5% [Digikey: 490-1415-1-ND] 56pF 50V 5% [Digikey: 490-1421-1-ND] 220pF 50V 5% [Digikey: 445-1285-1-ND] 680 pF 50V 2200 pF 50V 5% C0G [Digikey: 445-1297-1-ND] 5600 pF 100V 5% X7R [Digikey: 478-3711-1-ND] 0.1 µF 25V 10% [Digikey: PCC2277TR-ND] 0.22 µF 16V 10% X7R [Digikey: 445-1318-1-ND] 1.0 µF 25V 10% [Digikey: 445-5146-2-ND] 0603 - RF Specific 3pF 250V +/-0.1pF RF [Digikey: 712-1347-1-ND] 18 pF 250V 5% [Digikey: 478-3505-1-ND or 712-1322-1-ND] 56 pF 250V 5% C0G RF [Digikey: 490-4867-1-ND] 68 pF 250V RF [Digikey: 490-4868-1-ND] 0805 - 0805 Surface Mount Capacitors 220 pF 250V 2% RF Ceramic Capacitor [Digikey: 712-1398-1-ND] 1000 pF 50V 2% NP0 Ceramic Capacitor [Digikey: 478-3760-1-ND] 0.1 µF 25V 10% Ceramic Capacitor [Digikey: PCC1828TR-ND] 1.0 µF 16V 10% Ceramic Capacitor[Digikey: 490-1691-2-ND] 10.0 µF 10V 10% Ceramic Capacitor[Digikey: 709-1228-1-ND] 10.0 uF 16V 10% Ceramic Capacitor [Digikey: 478-5165-2-ND] 47 uF 6.3V 20% Ceramic Capacitor [Digikey: 587-1779-1-ND or 399-5506-1-ND] 1206 - 1206 Surface Mount Capacitors 47uF 10V 20% Ceramic Capacitor [Digikey: 490-5528-1-ND or 399-5508-1-ND or 445-6010-1-ND] 100uF 6.3V -20%, +80% Y5V Ceramic Capacitor (Digikey: 490-4512-1-ND, Mouser: 81-GRM31CF50J107ZE1L)
C4 C5 C7 C10-C15 C19 C27 C28 = SparkFun-Capacitors:0.1UF-25V(+80/-20%)(0603): CAP-00810 Ceramic Standard decoupling cap; PROD_ID: CAP-00810
CONN1 = Hermes_development:MCA_CONN_182
ESPHEADER = pinhead:PINHD-2X4: PIN HEADER
IC1 = micro-mc68000:MC68030RC: 68xxx PROCESSOR; MF: MOTOROLA; MPN: MC68030RC50C; OC_FARNELL: unknown; OC_NEWARK: 52F3269
IC2 = SparkFun-PowerIC:V_REG_LM1117: Voltage Regulator LM1117 Standard adjustable voltage regulator but in SMD form. Spark Fun Electronics SKU : COM-00595; PROD_ID: VREG-08170
IC7 IC8 = SamacSys_Parts:MT48LC16M16A2P-6A_G: MT48LC16M16A2P-6A:G, SDRAM Memory 256mb Surface Mount, 3 3.6 V, 0 +70 C, 54-pin, TSOP <https://componentsearchengine.com/Images/3/MT48LC16M16A2P-6A_G.jpg> Source: Datasheet <http://www.micron.com/~/media/documents/products/data-sheet/dram/256mb_sdr.pdf>; DESCRIPTION: MT48LC16M16A2P-6A:G, SDRAM Memory 256mb Surface Mount, 3 3.6 V, 0 +70 C, 54-pin, TSOP; HEIGHT: 1.2mm; MANUFACTURER_NAME: Micron; MANUFACTURER_PART_NUMBER: MT48LC16M16A2P-6A:G; RS_PART_NUMBER: 7824553; SUPPLIER_NAME: RS
IDE = Hermes_development:87758-4416: 44 Pin - 2mm Dual Row Single Wafer, Vertical T/H HDR Source: http://www.molex.com/pdm_docs/sd/877580616_sd.pdf; MF: MOLEX; MPN: 87758-4416; OC_FARNELL: unknown; OC_NEWARK: 59J1588
JP1 = pinhead:PINHD-2X2: PIN HEADER
JTAG1 = microbuilder:HEADER-1X6: PIN HEADER
OSC2 = microbuilder:OSCILLATOR: Oscillators 3.2x2.5mm SMT 4.0MHz +/- 50ppm, 3.3V, 9mA, -40/+85°C - Digikey: 535-9752-1-ND 50MHz +/- 50ppm, 3.3V, 8mA, -10/+70°C - Digikey: 478-4792-1-ND 5x7mm SMT 4.0MHz +/-20ppm 3.3V, 20mA, -20/+70°C - Digikey: 535-9329-2-ND 50MHz +/- 25ppm 3.3V, 35mA, -40/+85°C - Digikey: 631-1197-1-ND
R4 R5 = SparkFun-Resistors:0.05OHM-1/5W-1%(0603); PROD_ID: RES-12535
RN2 RN3 = CAY16-103J4LF:CAY16-103J4LF: Res Thick Film Array 10K Ohm 5% 200ppm/C ISOL Molded 8-Pin 1206(4 X 0603) Convex SMD Paper T/R; AVAILABILITY: Good; DESCRIPTION: Res Thick Film Array 10K Ohm 5% ?200ppm/C ISOL Molded 8-Pin 1206(4 X 0603) Convex SMD Paper T/R; MF: Bourns; MP: CAY16-103J4LF; PACKAGE: 1206 Bourns; PRICE: 0.02 USD
U1-U4 = SN74CB3T3245PW:SN74CB3T3245PW: 8-BIT FET BUS SWITCH; AVAILABILITY: Unavailable; DESCRIPTION: 8-Bit FET 2.5-V/3.3-V Low-Voltage Bus Switch With 5-V Tolerant Level Shifter 20-TSSOP -40 to 85; MF: Texas Instruments; MP: SN74CB3T3245PW; PACKAGE: TSSOP-20 Texas Instruments; PRICE: None
XC95144XL = sjl540:SAMACSYS_PARTS_XC95144XL-10TQG144I: XC95144XL-10TQG144I XC95144XL-10TQG144I, CPLD XC9500XL Flash 144 Cells, 117 I/O, 8 Labs, ISP, 3 3.6 V 144-Pin TQFP <https://componentsearchengine.com/Images/3/XC95144XL-10TQG144I.jpg> Source: Datasheet <http://docs-europe.electrocomponents.com/webdocs/0c77/0900766b80c77f42.pdf>; DESCRIPTION: XC95144XL-10TQG144I XC95144XL-10TQG144I, CPLD XC9500XL Flash 144 Cells, 117 I/O, 8 Labs, ISP, 3 3.6 V 144-Pin TQFP; HEIGHT: 1.6mm; MANUFACTURER_NAME: XILINX; MANUFACTURER_PART_NUMBER: XC95144XL-10TQG144I; RS_PART_NUMBER: 6260624; SUPPLIER_NAME: RS